# EAGLE design mrf89xa (EAGLE 7.3.0)
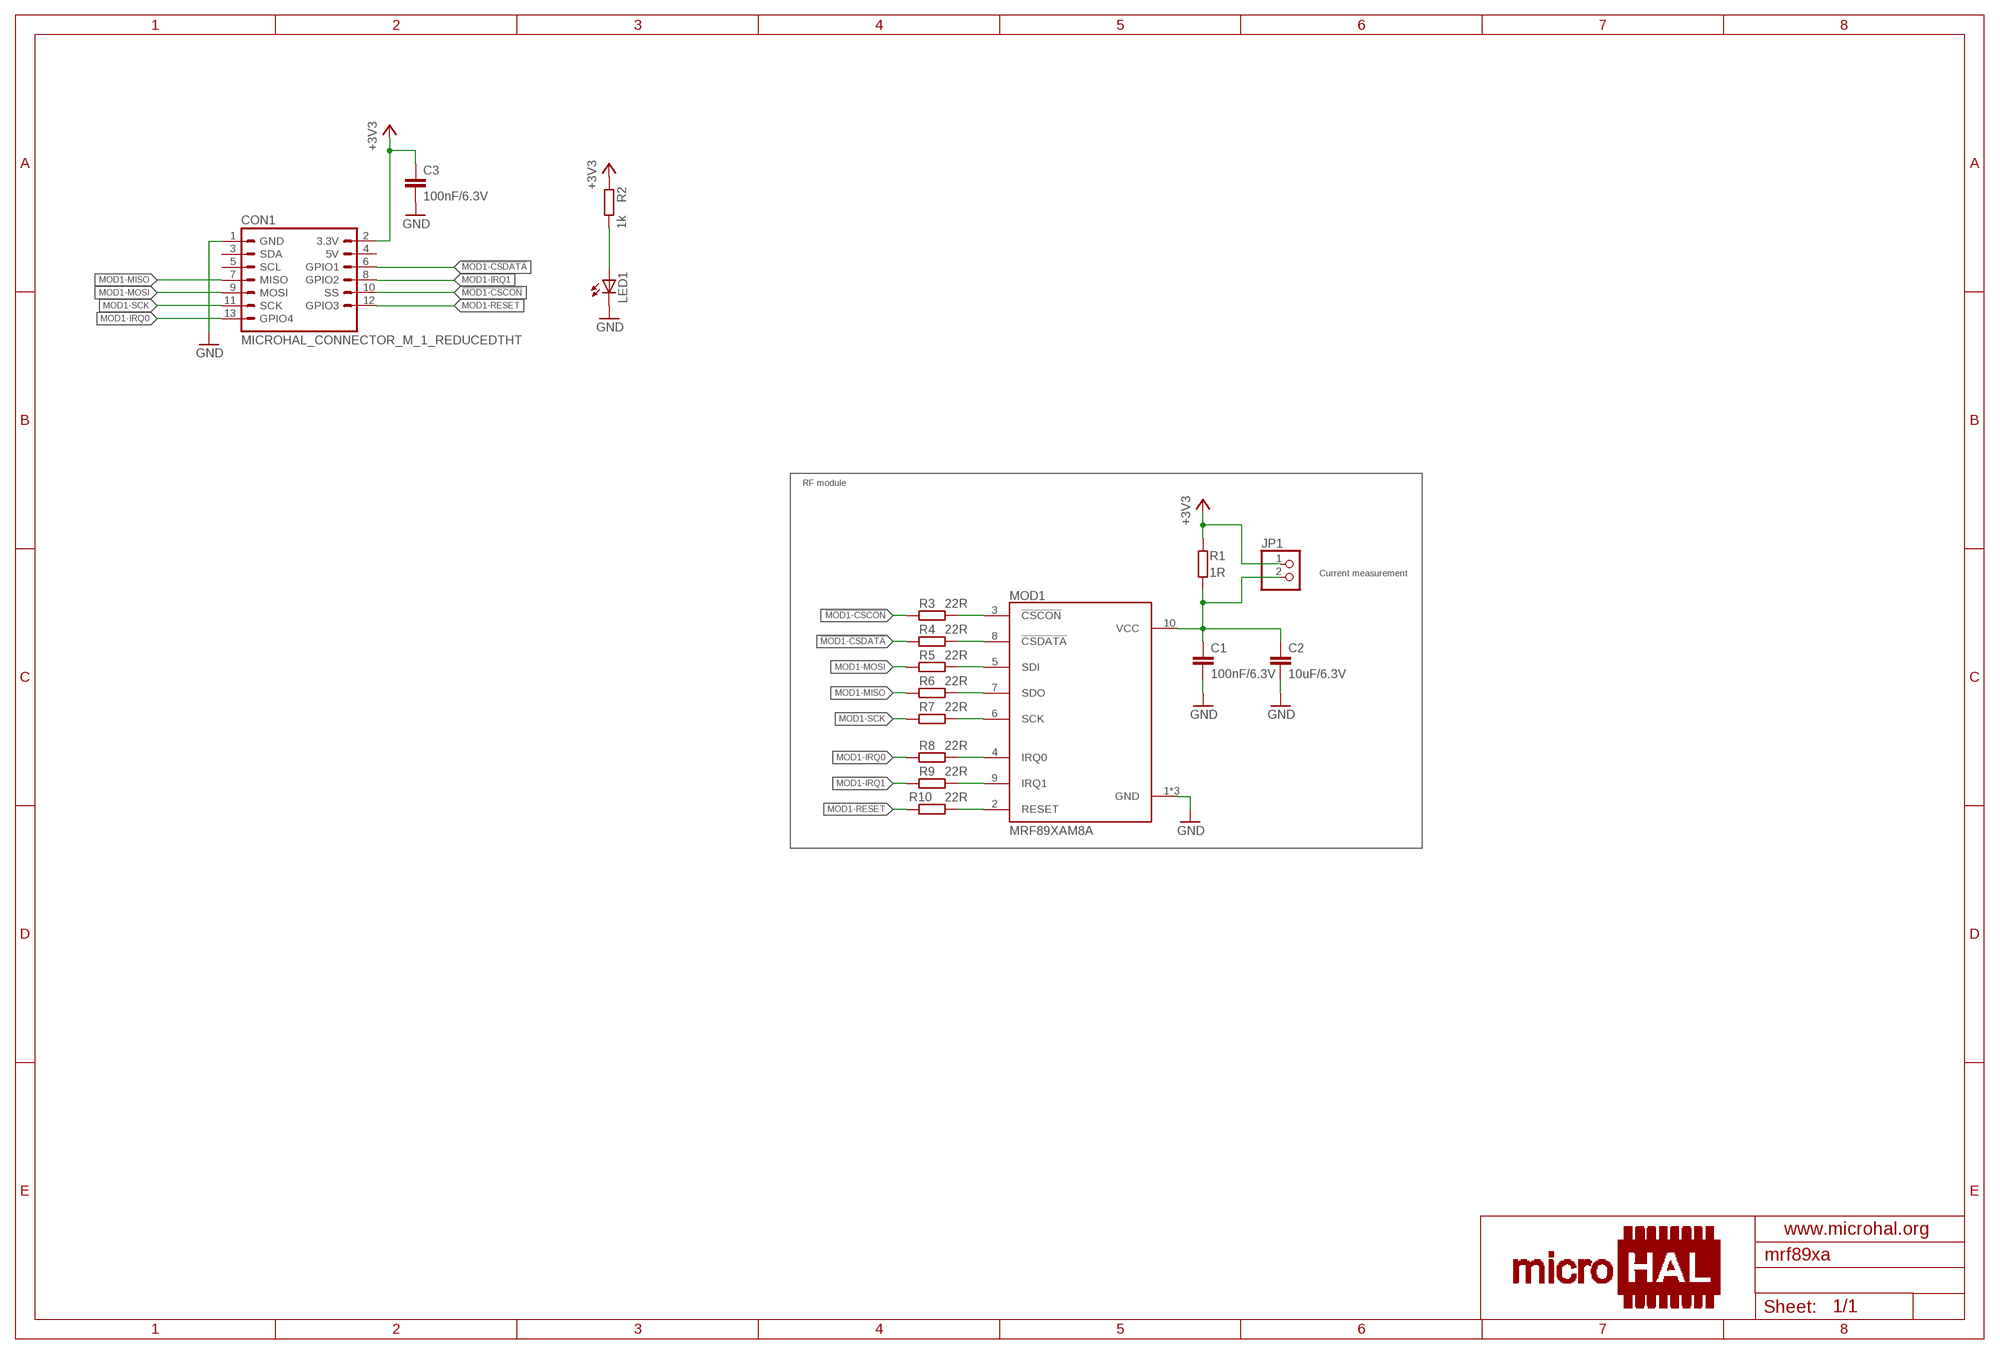
[diagram p0: schematic, sheet 1]

## Parts
C1  100nF/6.3V  C-EUC0603K  [C0603K]
C2  10uF/6.3V  C-EUC1206K  [C1206K]
C3  100nF/6.3V  C-EUC0603K  [C0603K]
CON1  MICROHAL_CONNECTOR_M_1_REDUCEDTHT  [MA07-2]
JP1  PINHD-1X2  [1X02]
LED1  LEDCHIP-LED0603  [CHIP-LED0603]
MOD1  MRF89XAM8A  [MRF89XAM8A]
R1  1R  R-EU_R0603  [R0603]
R2  1k  R-EU_R0603  [R0603]
R3  22R  R-EU_R0603  [R0603]
R4  22R  R-EU_R0603  [R0603]
R5  22R  R-EU_R0603  [R0603]
R6  22R  R-EU_R0603  [R0603]
R7  22R  R-EU_R0603  [R0603]
R8  22R  R-EU_R0603  [R0603]
R9  22R  R-EU_R0603  [R0603]
R10  22R  R-EU_R0603  [R0603]

## Nets
!MOD1-CSCON: CON1.10(SS) R3.2
!MOD1-CSDATA: CON1.6(GPIO1) R4.2
+3V3: C3.1 CON1.2(3.3V) JP1.1 R1.2 R2.2
GND: C1.2 C2.2 C3.2 CON1.1(GND) LED1.C MOD1.1(GND) MOD1.11(GND) MOD1.12(GND)
MOD1-IRQ0: CON1.13(GPIO4) R8.2
MOD1-IRQ1: CON1.8(GPIO2) R9.2
MOD1-MISO: CON1.7(MISO) R6.2
MOD1-MOSI: CON1.9(MOSI) R5.2
MOD1-RESET: CON1.12(GPIO3) R10.2
MOD1-SCK: CON1.11(SCK) R7.2
N$1: C1.1 C2.1 JP1.2 MOD1.10(VCC) R1.1
N$2: LED1.A R2.1
N$3: MOD1.3(!CSCON) R3.1
N$4: MOD1.8(!CSDATA) R4.1
N$5: MOD1.5(SDI) R5.1
N$6: MOD1.7(SDO) R6.1
N$7: MOD1.6(SCK) R7.1
N$8: MOD1.4(IRQ0) R8.1
N$9: MOD1.9(IRQ1) R9.1
N$10: MOD1.2(RESET) R10.1
Unconnected: CON1.3(SDA) CON1.4(5V) CON1.5(SCL)

## Notes on the sheet
- RF module
- Current measurement

## Library data of the parts
C1-C3 = rcl:C-EU: CAPACITOR, European symbol
CON1 = microhal-connector_v0.1:MICROHAL_CONNECTOR_M_1_REDUCED
JP1 = pinhead:PINHD-1X2: PIN HEADER
LED1 = led:LED: LED OSRAM: - CHIPLED LG R971, LG N971, LY N971, LG Q971, LY Q971, LO R971, LY R971 LH N974, LH R974 LS Q976, LO Q976, LY Q976 LO Q996 - Hyper CHIPLED LW Q18S LB Q993, LB Q99A, LB R99A - SideLED LS A670, LO A670, LY A670, LG A670, LP A670 LB A673, LV A673, LT A673, LW A673 LH A674 LY A675 LS A676, LA A676, LO A676, LY A676, LW A676 LS A679, LY A679, LG A679 - Hyper Micro SIDELED® LS Y876, LA Y876, LO Y876, LY Y876 LT Y87S - SmartLED LW L88C, LW L88S LB L89C, LB L89S, LG L890 LS L89K, LO L89K, LY L89K LS L896, LA L896, LO L896, LY L896 - TOPLED LS T670, LO T670, LY T670, LG T670, LP T670 LSG T670, LSP T670, LSY T670, LOP T670, LYG T670 LG T671, LOG T671, LSG T671 LB T673, LV T673, LT T673, LW T673 LH T674 LS T676, LA T676, LO T676, LY T676, LB T676, LH T676, LSB T676, LW T676 LB T67C, LV T67C, LT T67C, LS T67K, LO T67K, LY T67K, LW E67C LS E67B, LA E67B, LO E67B, LY E67B, LB E67C, LV E67C, LT E67C LW T67C LS T679, LY T679, LG T679 LS T770, LO T770, LY T770, LG T770, LP T770 LB T773, LV T773, LT T773, LW T773 LH T774 LS E675, LA E675, LY E675, LS T675 LS T776, LA T776, LO T776, LY T776, LB T776 LHGB T686 LT T68C, LB T68C - Hyper Mini TOPLED® LB M676 - Mini TOPLED Santana® LG M470 LS M47K, LO M47K, LY M47K Source: http://www.osram.convergy.de LUXEON: - LUMILED® LXK2-PW12-R00, LXK2-PW12-S00, LXK2-PW14-U00, LXK2-PW14-V00 LXK2-PM12-R00, LXK2-PM12-S00, LXK2-PM14-U00 LXK2-PE12-Q00, LXK2-PE12-R00, LXK2-PE12-S00, LXK2-PE14-T00, LXK2-PE14-U00 LXK2-PB12-K00, LXK2-PB12-L00, LXK2-PB12-M00, LXK2-PB14-N00, LXK2-PB14-P00, LXK2-PB14-Q00 LXK2-PR12-L00, LXK2-PR12-M00, LXK2-PR14-Q00, LXK2-PR14-R00 LXK2-PD12-Q00, LXK2-PD12-R00, LXK2-PD12-S00 LXK2-PH12-R00, LXK2-PH12-S00 LXK2-PL12-P00, LXK2-PL12-Q00, LXK2-PL12-R00 Source: www.luxeon.com KINGBRIGHT: KA-3528ASYC Source: www.kingbright.com
MOD1 = MRF89XAM8A:MRF89XAM8A
R1-R10 = rcl:R-EU_: RESISTOR, European symbol

## Board
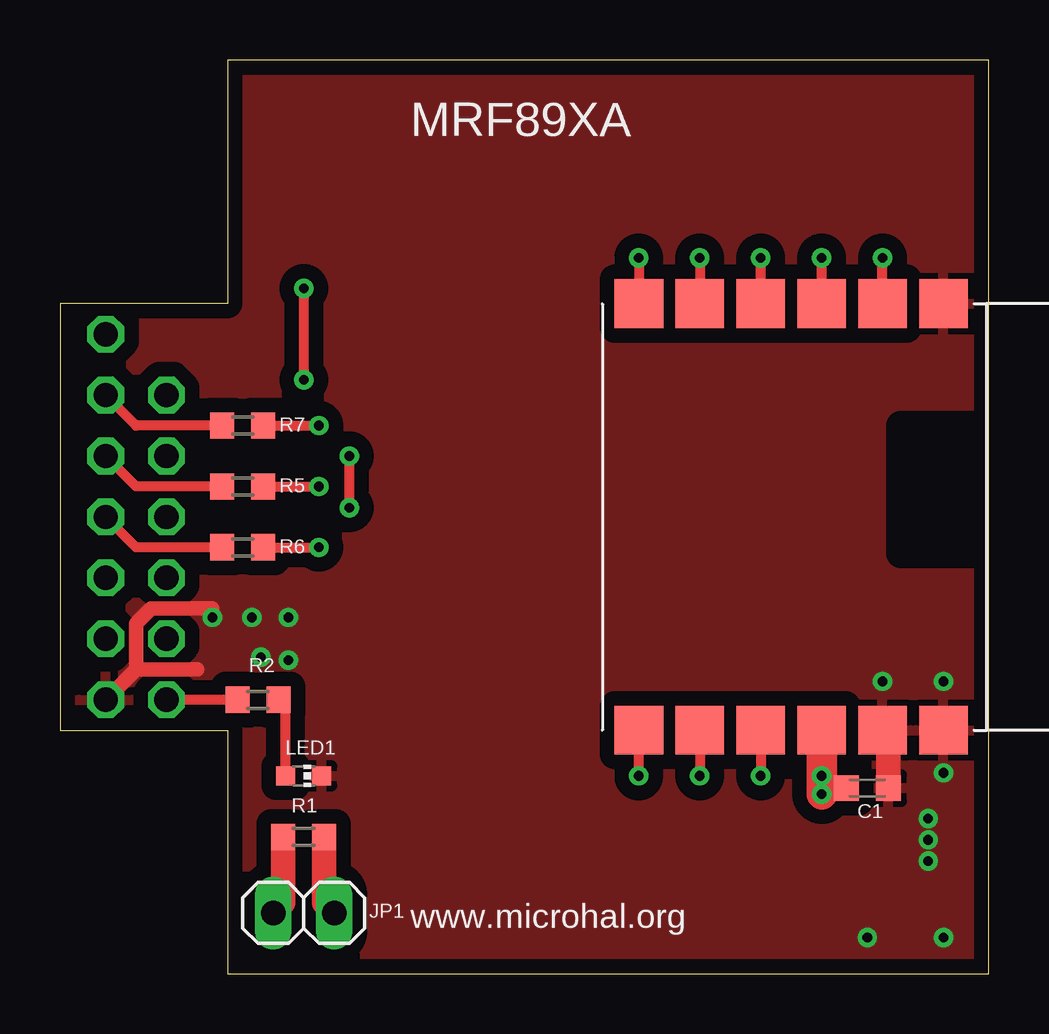
[diagram p1: board, top side]
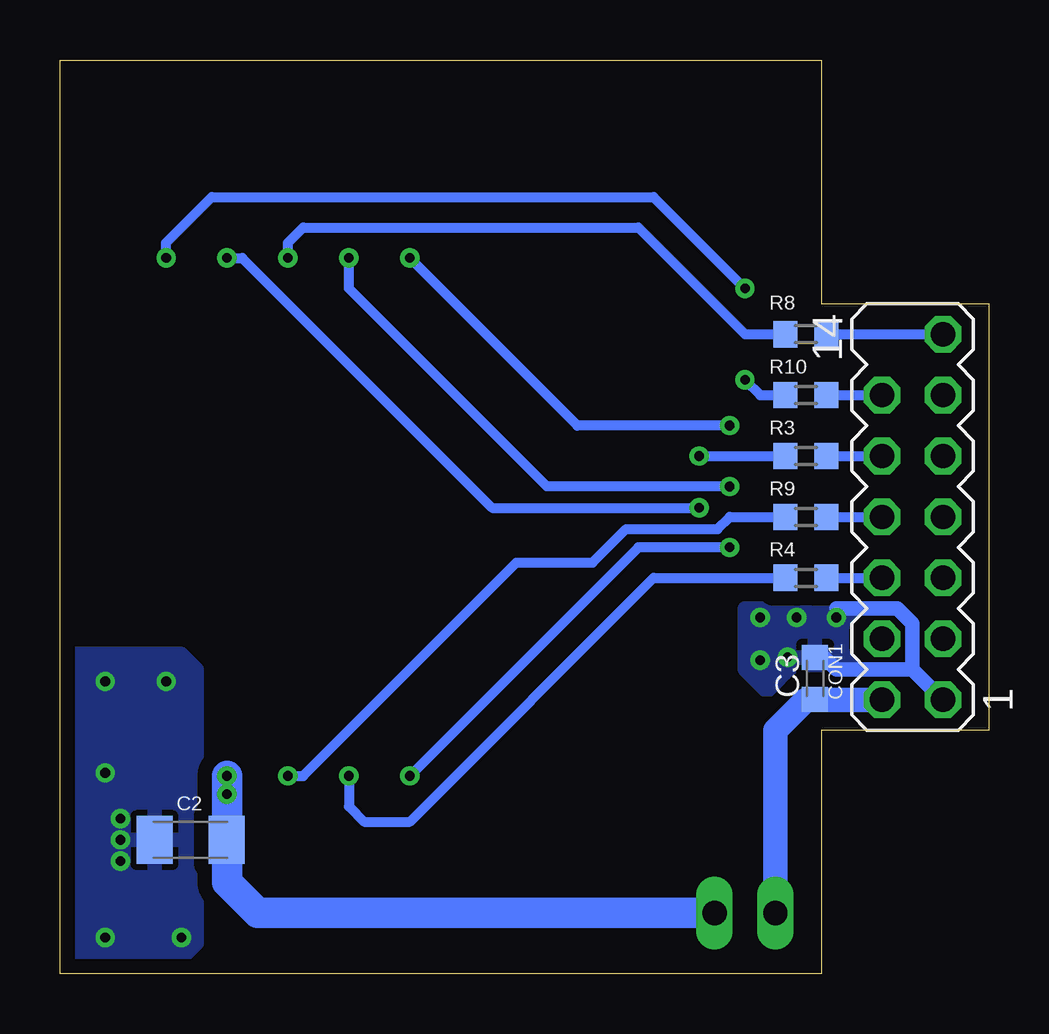
[diagram p2: board, bottom side, seen from below]

Size 38.72 x 38.1 mm. Coordinates in mm from the lower left corner, seen from the top.
Outline: 0,10.16 6.99,10.16 6.99,0 38.72,0 38.72,38.1 6.99,38.1 6.99,27.94 0,27.94 0,10.16
Copper layers (1*16): Top 0.035mm / dielectric 1.5mm / Bottom 0.035mm
Design rules "default *": minimum track width 10mil, minimum drill 14mil, track to track 8mil, track to pad 8mil, pad to pad 8mil, via to via 8mil, smd to smd 4mil, copper to edge 20mil, drill to drill 8mil, minimum pad ring 10mil, minimum via ring 8mil, stop-mask expansion 4mil, vias tented up to drill 0mil, thermal gap 10mil

### Footprints (pad centres in the part's own frame; a part is rotated, then mirrored left to right if it is on the bottom)
C0603K = smd 1.05 x 1.08: 1 -0.875,0; 2 0.875,0
C1206K = smd 1.5 x 2: 1 -1.5,0; 2 1.5,0
MA07-2 = drill 1.016 octagon: 1 -7.62,-1.27; 2 -7.62,1.27; 3 -5.08,-1.27; 4 -5.08,1.27; 5 -2.54,-1.27; 6 -2.54,1.27; 7 0,-1.27; 8 0,1.27; 9 2.54,-1.27; 10 2.54,1.27; 11 5.08,-1.27; 12 5.08,1.27; 13 7.62,-1.27
1X02 = drill 1.016 long: 1 -1.27,0; 2 1.27,0
CHIP-LED0603 = smd 0.8 x 0.8: A 0,-0.75; C 0,0.75
MRF89XAM8A = smd 2.032 x 2.032: 1 -8.89,6.35; 2 -8.89,3.81; 3 -8.89,1.27; 4 -8.89,-1.27; 5 -8.89,-3.81; 6 -8.89,-6.35; 7 8.89,-6.35; 8 8.89,-3.81; 9 8.89,-1.27; 10 8.89,1.27; 11 8.89,3.81; 12 8.89,6.35
R0603 = smd 1 x 1.1: 1 -0.85,0; 2 0.85,0

### Placement (x,y rotation side)
C1  33.66,7.75 0 top
C2  33.27,5.59 180 bottom
C3  7.24,12.32 90 bottom
CON1  3.17,19.05 90 bottom
JP1  10.16,2.54 0 top
LED1  10.16,8.26 270 top
MOD1  30.48,19.05 270 top
R1  10.16,5.71 180 top
R2  8.26,11.43 180 top
R3  7.62,21.59 0 bottom
R4  7.62,16.51 0 bottom
R5  7.62,20.32 180 top
R6  7.62,17.78 180 top
R7  7.62,22.86 180 top
R8  7.62,26.67 0 bottom
R9  7.62,19.05 0 bottom
R10  7.62,24.13 0 bottom

### Tracks (layer width: path | path; a pad name or v marks a point on that pad's centre or on a via)
!MOD1-CSCON
  Bottom 0.406: R3.2 CON1.10
!MOD1-CSDATA
  Bottom 0.406: R4.2 CON1.6
+3V3
  Top 0.406: R2.2 CON1.2
  Top 1.016: R1.2 9.31,2.96 JP1.1
  Bottom 0.61: C3.1 6.36,11.44 6.35,11.43
  Bottom 1.016: JP1.1 8.89,10.16 7.62,11.43 6.35,11.43 CON1.2
GND  (via drill 0.4)
  Top 0.61: CON1.1 3.17,12.7 | 3.17,12.7 5.71,12.7 | 3.17,12.7 3.17,14.61 3.81,15.24 6.35,15.24
  Top 1.016: C1.2 34.53,9.92 MOD1.11
  Bottom 0.61: C3.2 6.84,13.19 6.35,12.7 3.17,12.7 | 3.17,12.7 CON1.1 | 3.17,12.7 3.17,14.61 3.81,15.24 6.35,15.24
  other vias: 36.2,6.48 36.2,5.59 36.2,4.7 33.66,1.52 36.83,1.52 36.83,8.38 34.29,12.19 36.83,12.19 6.35,14.86 9.53,14.86 9.53,13.08 8.38,13.21 8,14.86
  pour Top (isolate 0.61): 7.62,38.1 38.73,38.1 38.73,0 6.99,0 6.99,10.16 0.64,10.16 0.64,27.94 7.62,27.94
  pour Bottom (isolate 0.61): 38.73,0 34.29,0 33.02,1.27 33.02,12.7 33.66,13.34 38.73,13.34
  pour Bottom (isolate 0.61): 4.45,15.24 4.45,11.43 8.89,11.43 10.16,12.7 10.16,15.24
MOD1-IRQ0
  Bottom 0.406: R8.2 CON1.13
MOD1-IRQ1
  Bottom 0.406: R9.2 CON1.8
MOD1-MISO
  Top 0.406: R6.2 3.17,17.78 CON1.7
MOD1-MOSI
  Top 0.406: R5.2 3.17,20.32 CON1.9
MOD1-RESET
  Bottom 0.406: R10.2 CON1.12
MOD1-SCK
  Top 0.406: R7.2 3.17,22.86 CON1.11
N$1  (via drill 0.4)
  Top 1.016: C1.1 32,7.75 v31.75,7.49 | R1.1 11.01,2.96 JP1.2
  Top 1.27: MOD1.10 v31.75,8.26 v31.75,7.49
  Bottom 1.016: C2.1 31.77,5.1 31.75,5.08
  Bottom 1.27: v31.75,8.26 31.75,5.08 31.75,3.81 30.48,2.54 JP1.2
N$2
  Top 0.406: LED1.A 9.41,11.12 R2.1
N$3  (via drill 0.4)
  Top 0.406: MOD1.3 v31.75,29.84 | v12.06,19.43 v12.06,21.59
  Bottom 0.406: v31.75,29.84 31.11,29.84 20.7,19.43 v12.06,19.43 | v12.06,21.59 R3.1
N$4  (via drill 0.4)
  Top 0.406: MOD1.8 v26.67,8.26
  Bottom 0.406: v26.67,8.26 26.67,6.99 26.04,6.35 24.13,6.35 13.97,16.51 R4.1
N$5  (via drill 0.4)
  Top 0.406: R5.1 v10.79,20.32 | v26.67,29.84 MOD1.5
  Bottom 0.406: v10.79,20.32 18.41,20.32 26.67,28.57 v26.67,29.84
N$6  (via drill 0.4)
  Top 0.406: R6.1 v10.79,17.78 | v24.13,8.26 MOD1.7
  Bottom 0.406: v10.79,17.78 14.61,17.78 v24.13,8.26
N$7  (via drill 0.4)
  Top 0.406: R7.1 v10.79,22.86 | v24.13,29.84 MOD1.6
  Bottom 0.406: v10.79,22.86 17.14,22.86 v24.13,29.84
N$8  (via drill 0.4)
  Top 0.406: MOD1.4 v29.21,29.84
  Bottom 0.406: v29.21,29.84 29.21,30.48 28.57,31.11 14.61,31.11 10.16,26.67 R8.1
N$9  (via drill 0.4)
  Top 0.406: MOD1.9 v29.21,8.26
  Bottom 0.406: v29.21,8.26 28.57,8.26 19.68,17.14 16.51,17.14 15.11,18.54 11.3,18.54 10.79,19.05 R9.1
N$10  (via drill 0.4)
  Top 0.406: MOD1.2 v34.29,29.84 | v10.16,28.57 v10.16,24.77
  Bottom 0.406: v34.29,29.84 34.29,30.48 32.38,32.39 13.97,32.39 v10.16,28.57 | v10.16,24.77 9.53,24.13 R10.1

### Text on the board
tPlace: MRF89XA | www.microhal.org